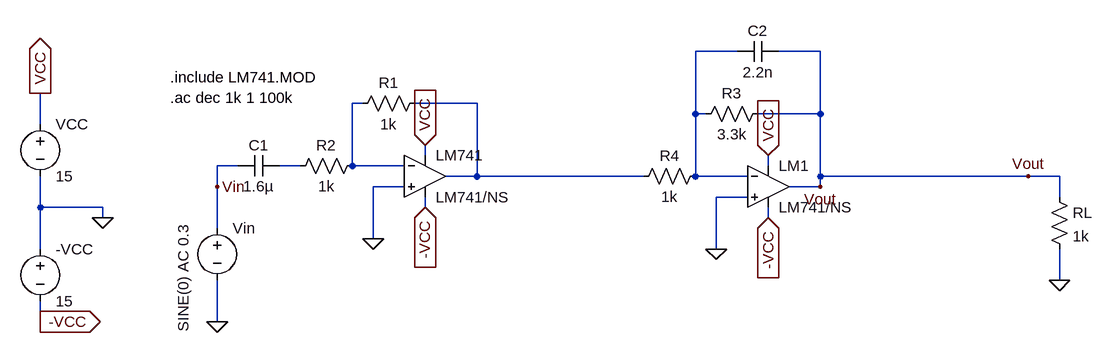
[diagram p0: schematic lab6task3.asc]
lab6task3.asc, the LTspice schematic file:
Version 4
SHEET 1 1380 680
WIRE 832 144 768 144
WIRE 960 144 896 144
WIRE 256 224 240 224
WIRE 432 224 336 224
WIRE 768 240 768 144
WIRE 784 240 768 240
WIRE 960 240 960 144
WIRE 960 240 864 240
WIRE -240 256 -240 208
WIRE 352 304 352 288
WIRE 64 320 32 320
WIRE 160 320 128 320
WIRE 240 320 240 224
WIRE 320 320 240 320
WIRE 880 320 880 304
WIRE 432 336 432 224
WIRE 432 336 384 336
WIRE 688 336 432 336
WIRE 768 336 768 240
WIRE 848 336 768 336
WIRE 960 336 960 240
WIRE 1280 336 960 336
WIRE 1328 336 1280 336
WIRE 32 352 32 320
WIRE 320 352 272 352
WIRE 960 352 960 336
WIRE 960 352 912 352
WIRE 848 368 800 368
WIRE 1328 368 1328 336
WIRE -240 384 -240 336
WIRE -144 384 -240 384
WIRE 352 384 352 368
WIRE -144 400 -144 384
WIRE 880 400 880 384
WIRE 32 416 32 352
WIRE 272 432 272 352
WIRE -240 448 -240 384
WIRE 800 448 800 368
WIRE 1328 496 1328 448
WIRE -240 560 -240 528
WIRE 32 560 32 496
WIRE -240 576 -240 560
FLAG -144 400 0
FLAG 272 432 0
FLAG 1328 496 0
FLAG 32 560 0
FLAG -240 208 VCC
IOPIN -240 208 Out
FLAG -240 560 -VCC
IOPIN -240 560 Out
FLAG 352 288 VCC
IOPIN 352 288 In
FLAG 352 384 -VCC
IOPIN 352 384 In
FLAG 32 352 Vin
FLAG 800 448 0
FLAG 880 304 VCC
IOPIN 880 304 In
FLAG 880 400 -VCC
IOPIN 880 400 In
FLAG 960 352 Vout
FLAG 1280 336 Vout
SYMBOL OpAmps/opamp2 352 272 R0
SYMATTR InstName LM741
SYMATTR Value LM741/NS
SYMBOL Voltage -240 240 R0
SYMATTR InstName VCC
SYMATTR Value 15
SYMBOL Voltage -240 432 R0
SYMATTR InstName -VCC
SYMATTR Value 15
SYMBOL Res 352 208 R90
WINDOW 0 0 56 VBottom 2
WINDOW 3 32 56 VTop 2
SYMATTR InstName R1
SYMATTR Value 1k
SYMBOL Res 256 304 R90
WINDOW 0 0 56 VBottom 2
WINDOW 3 32 56 VTop 2
SYMATTR InstName R2
SYMATTR Value 1k
SYMBOL Voltage 32 400 R0
WINDOW 3 -52 10 VRight 2
SYMATTR Value SINE(0) AC 0.3
SYMATTR InstName Vin
SYMBOL Res 1312 352 R0
SYMATTR InstName RL
SYMATTR Value 1k
SYMBOL Cap 128 304 R90
WINDOW 0 0 32 VBottom 2
WINDOW 3 32 32 VTop 2
SYMATTR InstName C1
SYMATTR Value 1.6µ
SYMBOL OpAmps/opamp2 880 288 R0
SYMATTR InstName LM1
SYMATTR Value LM741/NS
SYMBOL Res 880 224 R90
WINDOW 0 0 56 VBottom 2
WINDOW 3 32 56 VTop 2
SYMATTR InstName R3
SYMATTR Value 3.3k
SYMBOL Res 784 320 R90
WINDOW 0 0 56 VBottom 2
WINDOW 3 32 56 VTop 2
SYMATTR InstName R4
SYMATTR Value 1k
SYMBOL Cap 896 128 R90
WINDOW 0 0 32 VBottom 2
WINDOW 3 32 32 VTop 2
SYMATTR InstName C2
SYMATTR Value 2.2n
TEXT -40 184 Left 2 !.include LM741.MOD\n.ac dec 1k 1 100k

The netlist it stands for:
* lab6task3.asc
XLM741 0 N002 VCC -VCC N003 LM741/NS  ; pins In+ In- V+ V- OUT
VCC VCC 0 15
V§-VCC 0 -VCC 15
R1 N003 N002 1k
R2 N002 N004 1k
Vin Vin 0 SINE(0) AC 0.3
RL Vout 0 1k
C1 N004 Vin 1.6µ
XLM1 0 N001 VCC -VCC Vout LM741/NS  ; pins In+ In- V+ V- OUT
R3 Vout N001 3.3k
R4 N001 N003 1k
C2 Vout N001 2.2n
.include LM741.MOD
.ac dec 1k 1 100k
.backanno
.end